# EAGLE design S603D (EAGLE 6.6.0)
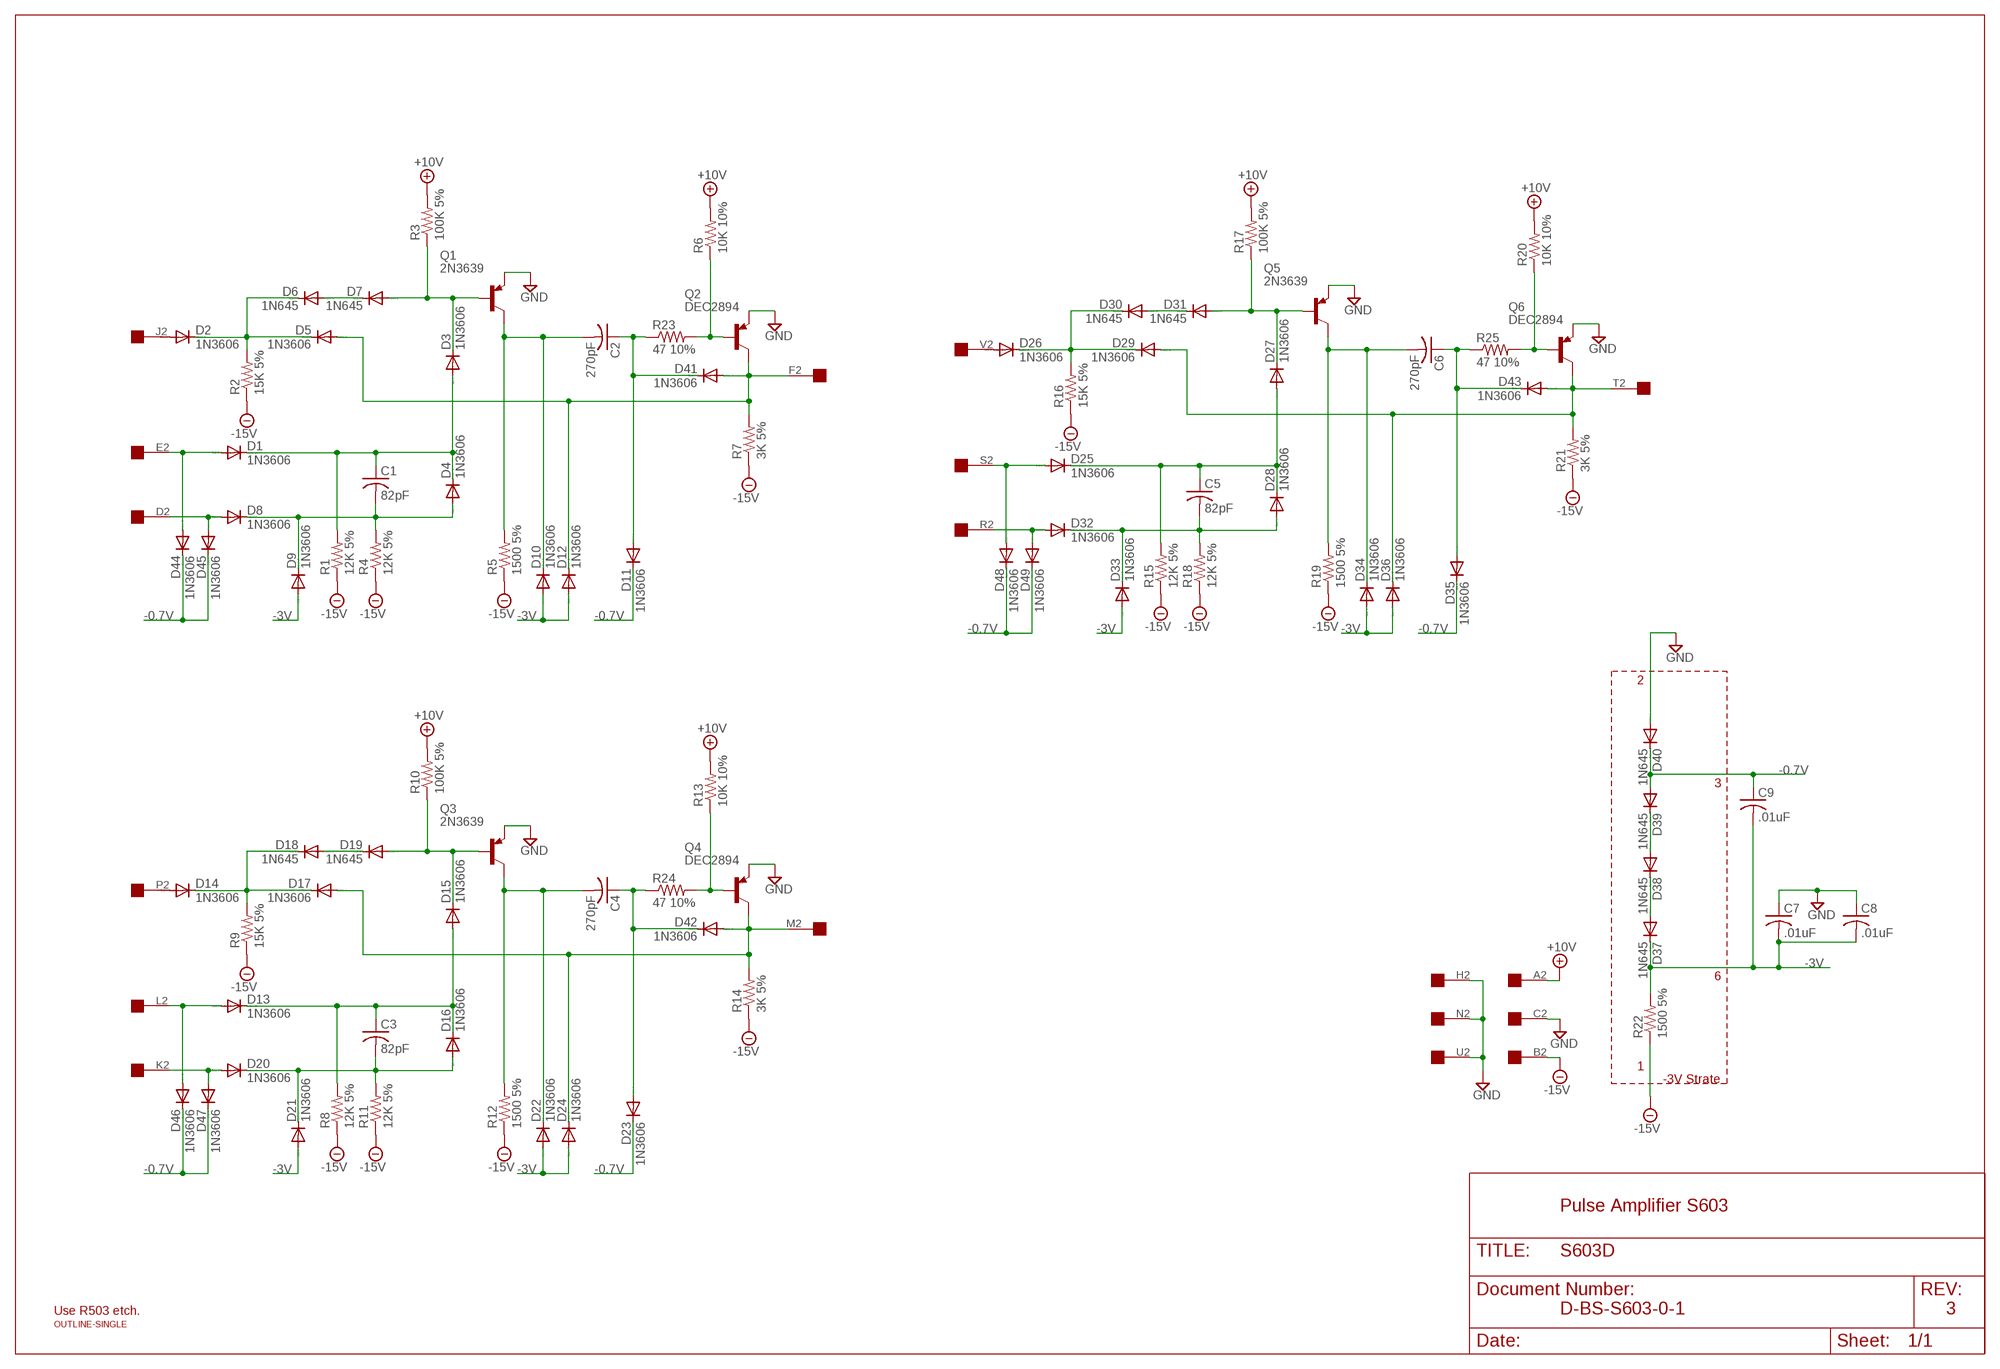
[diagram p0: schematic, sheet 1]

## Parts
C1  82pF  C-US050-025X075  [C050-025X075]
C2  270pF  C-US050-025X075  [C050-025X075]
C3  82pF  C-US050-025X075  [C050-025X075]
C4  270pF  C-US050-025X075  [C050-025X075]
C5  82pF  C-US050-025X075  [C050-025X075]
C6  270pF  C-US050-025X075  [C050-025X075]
C7  .01uF  C-US050-025X075  [C050-025X075]
C8  .01uF  C-US050-025X075  [C050-025X075]
C9  .01uF  C-US050-025X075  [C050-025X075]
D1  1N3606  1N4148DO35-10  [DO35-10]
D2  1N3606  1N4148DO35-10  [DO35-10]
D3  1N3606  1N4148DO35-10  [DO35-10]
D4  1N3606  1N4148DO35-10  [DO35-10]
D5  1N3606  1N4148DO35-10  [DO35-10]
D6  1N645  1N4148DO35-10  [DO35-10]
D7  1N645  1N4148DO35-10  [DO35-10]
D8  1N3606  1N4148DO35-10  [DO35-10]
D9  1N3606  1N4148DO35-10  [DO35-10]
D10  1N3606  1N4148DO35-10  [DO35-10]
D11  1N3606  1N4148DO35-10  [DO35-10]
D12  1N3606  1N4148DO35-10  [DO35-10]
D13  1N3606  1N4148DO35-10  [DO35-10]
D14  1N3606  1N4148DO35-10  [DO35-10]
D15  1N3606  1N4148DO35-10  [DO35-10]
D16  1N3606  1N4148DO35-10  [DO35-10]
D17  1N3606  1N4148DO35-10  [DO35-10]
D18  1N645  1N4148DO35-10  [DO35-10]
D19  1N645  1N4148DO35-10  [DO35-10]
D20  1N3606  1N4148DO35-10  [DO35-10]
D21  1N3606  1N4148DO35-10  [DO35-10]
D22  1N3606  1N4148DO35-10  [DO35-10]
D23  1N3606  1N4148DO35-10  [DO35-10]
D24  1N3606  1N4148DO35-10  [DO35-10]
D25  1N3606  1N4148DO35-10  [DO35-10]
D26  1N3606  1N4148DO35-10  [DO35-10]
D27  1N3606  1N4148DO35-10  [DO35-10]
D28  1N3606  1N4148DO35-10  [DO35-10]
D29  1N3606  1N4148DO35-10  [DO35-10]
D30  1N645  1N4148DO35-10  [DO35-10]
D31  1N645  1N4148DO35-10  [DO35-10]
D32  1N3606  1N4148DO35-10  [DO35-10]
D33  1N3606  1N4148DO35-10  [DO35-10]
D34  1N3606  1N4148DO35-10  [DO35-10]
D35  1N3606  1N4148DO35-10  [DO35-10]
D36  1N3606  1N4148DO35-10  [DO35-10]
D37  1N645  1N4148DO35-10  [DO35-10]
D38  1N645  1N4148DO35-10  [DO35-10]
D39  1N645  1N4148DO35-10  [DO35-10]
D40  1N645  1N4148DO35-10  [DO35-10]
D41  1N3606  1N4148DO35-10  [DO35-10]
D42  1N3606  1N4148DO35-10  [DO35-10]
D43  1N3606  1N4148DO35-10  [DO35-10]
D44  1N3606  1N4148DO35-10  [DO35-10]
D45  1N3606  1N4148DO35-10  [DO35-10]
D46  1N3606  1N4148DO35-10  [DO35-10]
D47  1N3606  1N4148DO35-10  [DO35-10]
D48  1N3606  1N4148DO35-10  [DO35-10]
D49  1N3606  1N4148DO35-10  [DO35-10]
Q1  2N3639  2N2904  [TO39]
Q2  DEC2894  2N2904  [TO39]
Q3  2N3639  2N2904  [TO39]
Q4  DEC2894  2N2904  [TO39]
Q5  2N3639  2N2904  [TO39]
Q6  DEC2894  2N2904  [TO39]
R1  12K 5%  R-US_0207/10  [0207/10]
R2  15K 5%  R-US_0207/10  [0207/10]
R3  100K 5%  R-US_0207/10  [0207/10]
R4  12K 5%  R-US_0207/10  [0207/10]
R5  1500 5%  R-US_0207/10  [0207/10]
R6  10K 10%  R-US_0207/10  [0207/10]
R7  3K 5%  R-US_0207/10  [0207/10]
R8  12K 5%  R-US_0207/10  [0207/10]
R9  15K 5%  R-US_0207/10  [0207/10]
R10  100K 5%  R-US_0207/10  [0207/10]
R11  12K 5%  R-US_0207/10  [0207/10]
R12  1500 5%  R-US_0207/10  [0207/10]
R13  10K 10%  R-US_0207/10  [0207/10]
R14  3K 5%  R-US_0207/10  [0207/10]
R15  12K 5%  R-US_0207/10  [0207/10]
R16  15K 5%  R-US_0207/10  [0207/10]
R17  100K 5%  R-US_0207/10  [0207/10]
R18  12K 5%  R-US_0207/10  [0207/10]
R19  1500 5%  R-US_0207/10  [0207/10]
R20  10K 10%  R-US_0207/10  [0207/10]
R21  3K 5%  R-US_0207/10  [0207/10]
R22  1500 5%  R-US_0207/10  [0207/10]
R23  47 10%  R-US_0207/10  [0207/10]
R24  47 10%  R-US_0207/10  [0207/10]
R25  47 10%  R-US_0207/10  [0207/10]
U$1  OUTLINE-SINGLE  [SINGLE]
U$2  EDGE-1  [EDGE-CON1]

## Nets
+10V [Supply]: R3.2 R6.2 R10.2 R13.2 R17.2 R20.2 U$2.A2
-0.7V [Supply]: C9.1 D11.C D23.C D35.C D39.A D40.C D44.C D45.C D46.C D47.C D48.C D49.C
-3V [Supply]: C7.2 C8.2 C9.2 D9.A D10.A D12.A D21.A D22.A D24.A D33.A D34.A D36.A D37.C R22.2
-15V [Supply]: R1.1 R2.1 R4.1 R5.1 R7.1 R8.1 R9.1 R11.1 R12.1 R14.1 R15.1 R16.1 R18.1 R19.1 R21.1 R22.1 U$2.B2
GND [Supply]: C7.1 C8.1 D40.A Q1.1(E) Q2.1(E) Q3.1(E) Q4.1(E) Q5.1(E) Q6.1(E) U$2.C2 U$2.H2 U$2.N2 U$2.U2
N$1: D2.A U$2.J2
N$2: D2.C D5.C D6.C R2.2
N$3: D1.A D44.A U$2.E2
N$4: D8.A D45.A U$2.D2
N$5: C1.1 D1.C D3.A D4.C R1.2
N$6: C1.2 D4.A D8.C D9.C R4.2
N$7: D6.A D7.C
N$8 [Supply]: D38.A D39.C
N$9 [Supply]: D37.A D38.C
N$10: D3.C D7.A Q1.2(B) R3.1
N$11: C2.2 D10.C Q1.3(C) R5.2
N$12: C2.1 D11.A D41.C R23.1
N$13: Q2.2(B) R6.1 R23.2
N$14: D5.A D12.C D41.A Q2.3(C) R7.2 U$2.F2
N$15: D13.A D46.A U$2.L2
N$16: D20.A D47.A U$2.K2
N$17: C3.1 D13.C D15.A D16.C R8.2
N$18: C3.2 D16.A D20.C D21.C R11.2
N$19: D25.A D48.A U$2.S2
N$20: D32.A D49.A U$2.R2
N$21: C5.1 D25.C D27.A D28.C R15.2
N$22: C5.2 D28.A D32.C D33.C R18.2
N$23: D26.A U$2.V2
N$24: D26.C D29.C D30.C R16.2
N$25: D30.A D31.C
N$26: D27.C D31.A Q5.2(B) R17.1
N$27: C6.2 D34.C Q5.3(C) R19.2
N$28: C6.1 D35.A D43.C R25.1
N$29: Q6.2(B) R20.1 R25.2
N$30: D29.A D36.C D43.A Q6.3(C) R21.2 U$2.T2
N$31: D14.A U$2.P2
N$32: D14.C D17.C D18.C R9.2
N$33: D18.A D19.C
N$34: D15.C D19.A Q3.2(B) R10.1
N$35: C4.2 D22.C Q3.3(C) R12.2
N$36: C4.1 D23.A D42.C R24.1
N$37: Q4.2(B) R13.1 R24.2
N$38: D17.A D24.C D42.A Q4.3(C) R14.2 U$2.M2

## Notes on the sheet
- 2
- 3
- 6
- 1
- -3V Strate
- Pulse Amplifier S603
- Use R503 etch. | D-BS-S603-0-1 | 3

## Library data of the parts
C1-C9 = rcl:C-US: CAPACITOR, American symbol
D1-D49 = diode:1N4148: DIODE high speed (Philips)
Q1-Q6 = transistor-pnp:2N2904*: PNP Transistror
R1-R25 = rcl:R-US_: RESISTOR, American symbol
U$1 = dec-con:OUTLINE-*: Board outlines for DEC boards.
U$2 = dec-con:EDGE-1: Single-Sided DEC Edge Connector -- (side 2)

## Net classes
1 Supply: width 0.813 mm

## Board
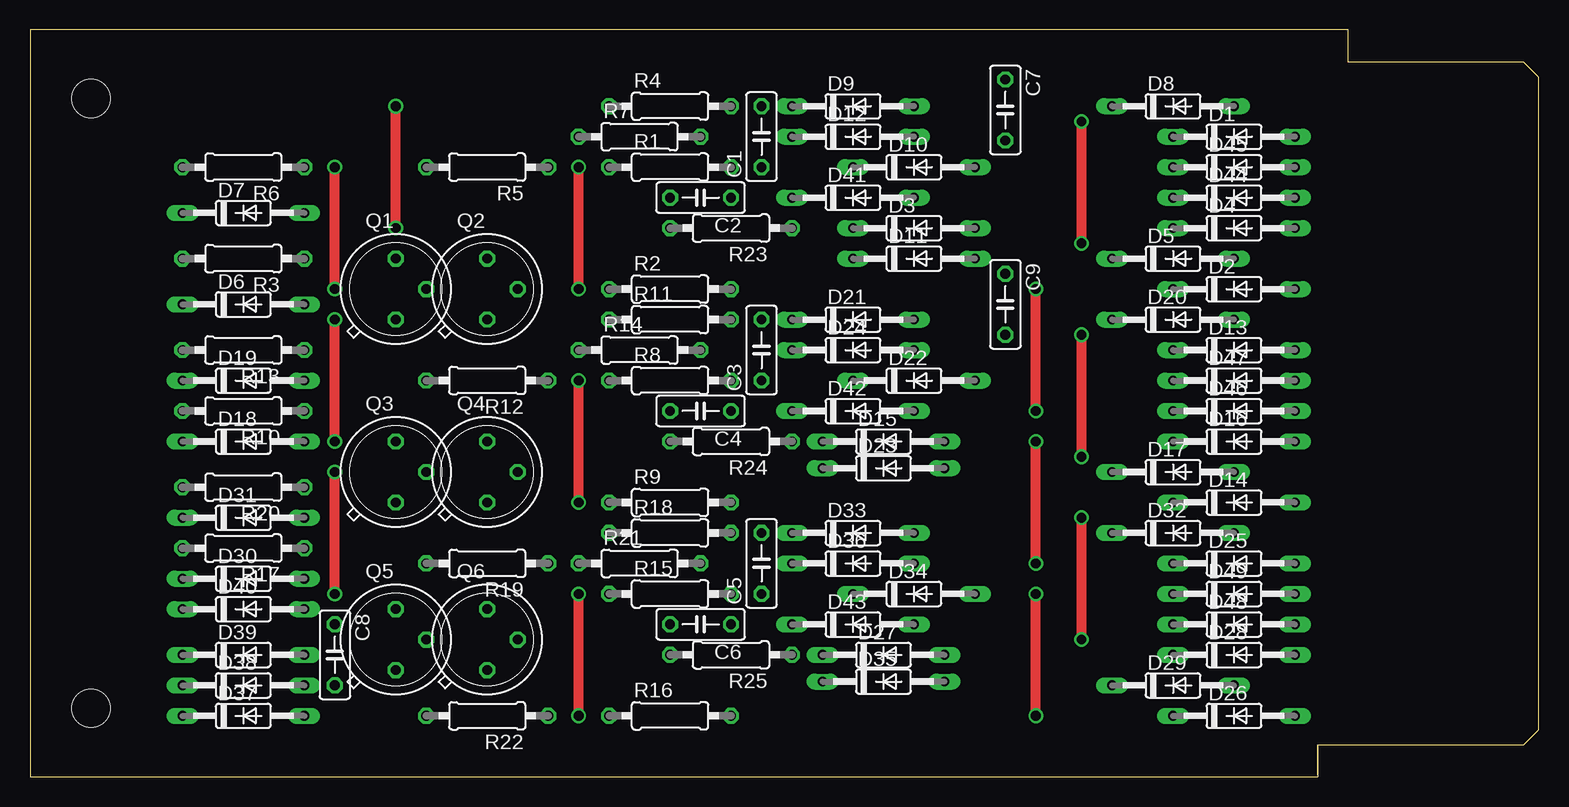
[diagram p1: board, top side]
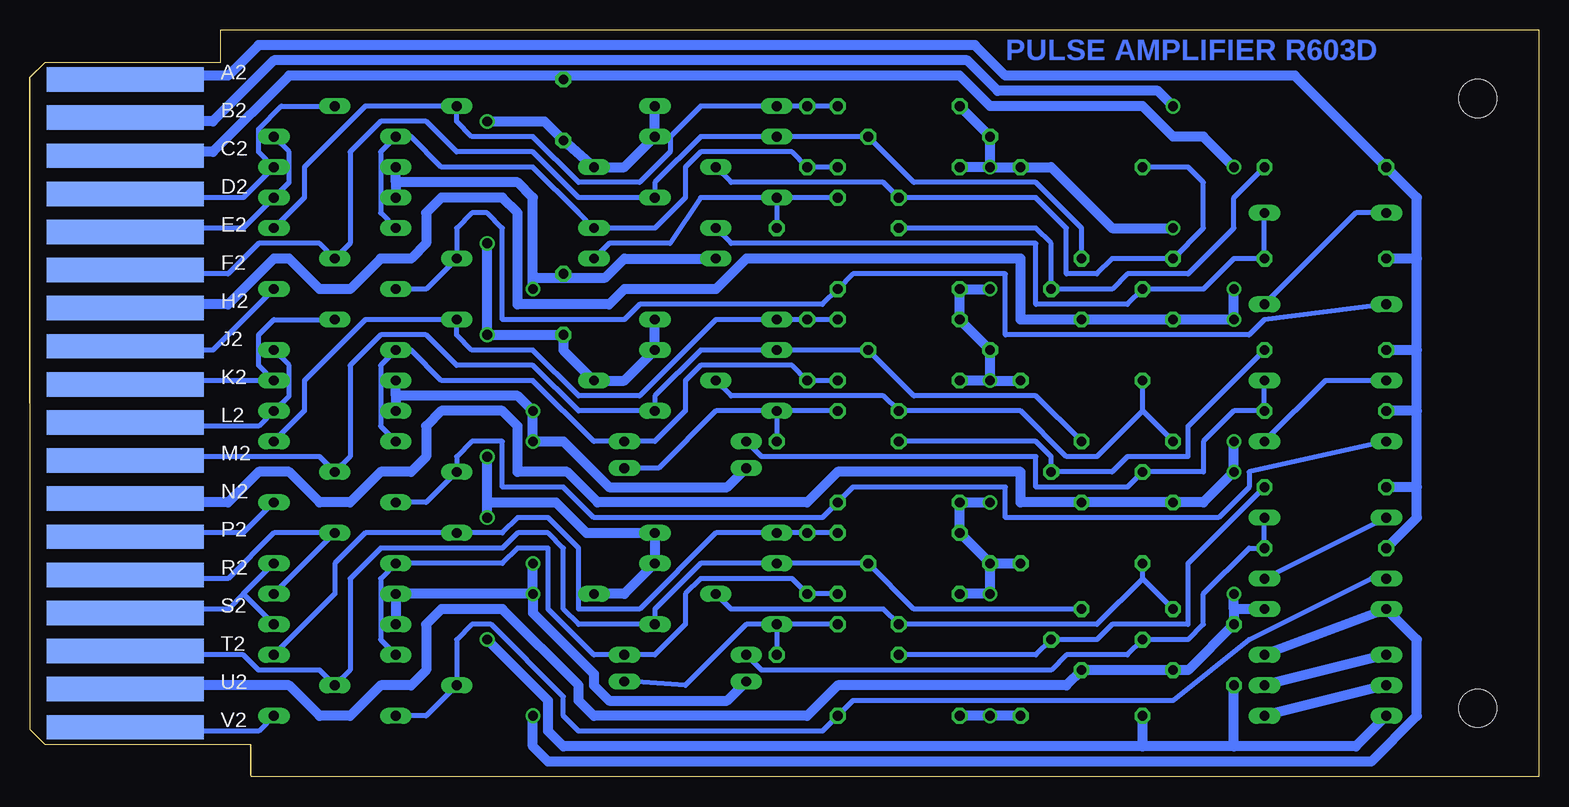
[diagram p2: board, bottom side, seen from below]

Size 125.73 x 62.23 mm. Coordinates in mm from the lower left corner, seen from the top.
Copper layers (1+16): Top 0.035mm / dielectric 1.5mm / Bottom 0.035mm
Design rules "16mils": minimum track width 16mil, minimum drill 32mil, track to track 15mil, track to pad 10mil, pad to pad 10mil, via to via 10mil, smd to smd 10mil, copper to edge 13mil, drill to drill 10mil, minimum pad ring 10mil, minimum via ring 8mil, stop-mask expansion 0mil, vias tented up to drill 0mil, thermal gap 10mil

### Footprints (pad centres in the part's own frame; a part is rotated, then mirrored left to right if it is on the bottom)
C050-025X075 = drill 0.813 octagon: 1 -2.54,0; 2 2.54,0
DO35-10 = drill 0.813 long: A 5.08,0; C -5.08,0
TO39 = drill 0.813 octagon: 1 0,-2.54; 2 2.54,0; 3 0,2.54
0207/10 = drill 0.813 octagon: 1 -5.08,0; 2 5.08,0
SINGLE = hole 3.175: 120.65,56.515; 120.65,5.715
EDGE-CON1 = smd 13.106 x 2.032 bottom: A2 7.938,4.128; B2 7.938,7.303; C2 7.938,10.477; D2 7.938,13.652; E2 7.938,16.828; F2 7.938,20.003; H2 7.938,23.177; J2 7.938,26.352; K2 7.938,29.527; L2 7.938,32.703; M2 7.938,35.877; N2 7.938,39.053; P2 7.938,42.227; R2 7.938,45.403; S2 7.938,48.578; T2 7.938,51.752; U2 7.938,54.928; V2 7.938,58.102

### Placement (x,y rotation side)
C1  60.96,53.34 90 top
C2  55.88,48.26 180 top
C3  60.96,35.56 90 top
C4  55.88,30.48 180 top
C5  60.96,17.78 90 top
C6  55.88,12.7 180 top
C7  81.28,55.56 270 top
C8  25.4,10.16 270 top
C9  81.28,39.37 270 top
D1  100.33,53.34 0 top
D2  100.33,40.64 0 top
D3  73.66,45.72 0 top
D4  100.33,45.72 0 top
D5  95.25,43.18 0 top
D6  17.78,39.37 0 top
D7  17.78,46.99 0 top
D8  95.25,55.88 0 top
D9  68.58,55.88 0 top
D10  73.66,50.8 0 top
D11  73.66,43.18 0 top
D12  68.58,53.34 0 top
D13  100.33,35.56 0 top
D14  100.33,22.86 0 top
D15  71.12,27.94 0 top
D16  100.33,27.94 0 top
D17  95.25,25.4 0 top
D18  17.78,27.94 0 top
D19  17.78,33.02 0 top
D20  95.25,38.1 0 top
D21  68.58,38.1 0 top
D22  73.66,33.02 0 top
D23  71.12,25.72 0 top
D24  68.58,35.56 0 top
D25  100.33,17.78 0 top
D26  100.33,5.08 0 top
D27  71.12,10.16 0 top
D28  100.33,10.16 0 top
D29  95.25,7.62 0 top
D30  17.78,16.51 0 top
D31  17.78,21.59 0 top
D32  95.25,20.32 0 top
D33  68.58,20.32 0 top
D34  73.66,15.24 0 top
D35  71.12,7.94 0 top
D36  68.58,17.78 0 top
D37  17.78,5.08 0 top
D38  17.78,7.62 0 top
D39  17.78,10.16 0 top
D40  17.78,13.97 0 top
D41  68.58,48.26 0 top
D42  68.58,30.48 0 top
D43  68.58,12.7 0 top
D44  100.33,48.26 0 top
D45  100.33,50.8 0 top
D46  100.33,30.48 0 top
D47  100.33,33.02 0 top
D48  100.33,12.7 0 top
D49  100.33,15.24 0 top
Q1  30.48,40.64 0 top
Q2  38.1,40.64 0 top
Q3  30.48,25.4 0 top
Q4  38.1,25.4 0 top
Q5  30.48,11.43 0 top
Q6  38.1,11.43 0 top
R1  53.34,50.8 0 top
R2  53.34,40.64 0 top
R3  17.78,43.18 180 top
R4  53.34,55.88 0 top
R5  38.1,50.8 180 top
R6  17.78,50.8 180 top
R7  50.8,53.34 0 top
R8  53.34,33.02 0 top
R9  53.34,22.86 0 top
R10  17.78,30.48 180 top
R11  53.34,38.1 0 top
R12  38.1,33.02 180 top
R13  17.78,35.56 180 top
R14  50.8,35.56 0 top
R15  53.34,15.24 0 top
R16  53.34,5.08 0 top
R17  17.78,19.05 180 top
R18  53.34,20.32 0 top
R19  38.1,17.78 180 top
R20  17.78,24.13 180 top
R21  50.8,17.78 0 top
R22  38.1,5.08 180 top
R23  58.42,45.72 180 top
R24  58.42,27.94 180 top
R25  58.42,10.16 180 top
U$1  125.73,62.23 180 top
U$2  125.73,62.23 180 top

### Tracks (layer width: path | path; a pad name or v marks a point on that pad's centre or on a via)
+10V
  Bottom 0.813: U$2.A2 116.84,58.04 116.84,58.42 109.22,58.42 106.68,60.96 46.99,60.96 44.45,58.42 20.32,58.42 R6.2 10.16,48.26 10.16,43.18 | 10.16,24.13 10.16,21.59 R17.2 | 10.16,24.13 10.16,30.48 | 10.16,30.48 10.16,35.56 | 10.16,35.56 10.16,43.18 | 10.16,24.13 R20.2 | 10.16,30.48 R10.2 | 10.16,35.56 R13.2 | 10.16,43.18 R3.2
-0.7V  (via drill 0.81)
  Top 0.813: v83.82,5.08 v83.82,15.24 | v83.82,17.78 v83.82,27.94 | v83.82,30.48 v83.82,40.64
  Bottom 0.813: 95.25,49.53 D45.C | 95.25,49.53 D44.C | 95.25,31.75 D47.C | 95.25,31.75 D46.C | D48.C D49.C v83.82,15.24 | v83.82,15.24 v83.82,17.78 | 95.25,31.75 85.09,31.75 v83.82,30.48 v83.82,27.94 81.28,27.94 77.47,24.13 67.63,24.13 D23.C | 95.25,49.53 85.09,49.53 83.82,48.26 83.82,41.91 | v83.82,40.64 83.82,41.91 | D39.A D40.C 10.16,11.43 10.16,5.08 13.97,1.27 82.55,1.27 83.82,2.54 v83.82,5.08 | 83.82,41.91 83.82,41.59 81.28,41.59 | 80.96,41.91 C9.1 81.28,41.59 | 81.28,41.59 77.79,41.59 76.2,43.18 D11.C | D35.C 67.63,6.35 77.47,6.35 78.74,7.62 78.74,8.57 83.82,13.65 v83.82,15.24
-3V  (via drill 0.81)
  Top 0.813: v87.63,44.45 v87.63,54.61 | v87.63,26.67 v87.63,36.83 | v87.63,11.43 v87.63,21.59
  Bottom 0.813: v87.63,44.45 v87.63,36.83 C9.2 81.28,35.56 D22.A 76.2,33.02 D24.A D21.A | v87.63,21.59 87.63,22.86 | 87.63,22.86 v87.63,26.67 | v87.63,54.61 82.87,54.61 C7.2 D10.A 76.2,50.8 D12.A D9.A | D37.C 15.24,2.54 25.4,2.54 | 25.4,2.54 33.02,2.54 | 25.4,2.54 C8.2 | 33.02,2.54 R22.2 | 33.02,2.54 81.28,2.54 82.55,3.81 82.55,6.35 v87.63,11.43 | D34.A 76.2,15.24 D36.A D33.A 79.38,20.32 81.92,22.86 87.63,22.86
-15V  (via drill 0.81)
  Top 0.813: v45.72,40.64 v45.72,50.8 | v30.48,45.72 v30.48,55.88 | v45.72,5.08 v45.72,15.24 | v45.72,22.86 v45.72,33.02
  Bottom 0.813: U$2.B2 117.13,54.9 116.84,54.61 110.49,54.61 105.41,59.69 47.62,59.69 45.09,57.15 31.75,57.15 v30.48,55.88 | R4.1 R7.1 v45.72,50.8 | v45.72,50.8 R1.1 | v30.48,45.72 35.56,45.72 40.64,50.8 R5.1 v45.72,50.8 | v45.72,33.02 R12.1 | v45.72,33.02 R14.1 R11.1 R2.1 | R2.1 v45.72,40.64 R2.1 | R22.1 v45.72,5.08 R16.1 | R21.1 v45.72,15.24 R15.1 | R21.1 R18.1 R9.1 v45.72,22.86 | R21.1 R19.1 | v45.72,33.02 R8.1
GND  (via drill 0.81)
  Top 0.813: v25.4,40.64 v25.4,50.8 | v25.4,27.94 v25.4,38.1 | v25.4,15.24 v25.4,25.4
  Bottom 0.813: U$2.C2 117.17,51.74 116.84,52.07 110.49,52.07 104.14,58.42 81.28,58.42 | U$2.H2 117.17,39.04 116.84,39.37 109.22,39.37 105.41,43.18 104.14,43.18 101.6,40.64 99.06,40.64 96.52,43.18 93.98,43.18 92.71,44.45 92.71,46.99 91.44,48.26 86.36,48.26 85.09,46.99 85.09,39.37 77.47,39.37 76.2,40.64 68.58,40.64 66.04,43.18 43.18,43.18 43.18,38.1 Q2.1 Q1.1 v25.4,38.1 v25.4,40.64 | U$2.N2 117.17,23.19 116.84,22.86 109.22,22.86 106.68,25.4 104.14,25.4 101.6,22.86 99.06,22.86 96.52,25.4 93.98,25.4 92.71,26.67 92.71,29.21 91.44,30.48 86.36,30.48 85.09,29.21 85.09,25.4 80.96,25.4 78.42,22.86 60.96,22.86 58.42,25.4 43.18,25.4 43.18,22.86 Q4.1 Q3.1 27.94,22.86 v25.4,25.4 v25.4,27.94 | U$2.U2 117.2,7.26 116.84,7.62 104.14,7.62 101.6,5.08 99.06,5.08 96.52,7.62 93.98,7.62 92.71,8.89 92.71,12.7 91.44,13.97 86.36,13.97 80.01,7.62 80.01,6.35 78.74,5.08 60.96,5.08 58.42,7.62 39.37,7.62 Q6.1 Q5.1 29.21,8.89 C8.1 25.4,13.97 | 81.28,58.42 C7.1 | 81.28,58.42 48.26,58.42 45.72,55.88 33.02,55.88 30.48,53.34 27.94,53.34 v25.4,50.8 | D40.A 25.4,13.97 | 25.4,13.97 v25.4,15.24
N$1
  Bottom 0.406: U$2.J2 117.17,35.89 116.84,35.56 110.49,35.56 D2.A
N$2
  Bottom 0.406: D2.C 92.71,40.64 D5.C 90.17,45.72 88.9,46.99 87.63,46.99 86.36,45.72 86.36,38.1 76.2,38.1 74.93,39.37 59.69,39.37 R2.2 57.15,41.91 44.45,41.91 44.45,36.83 24.13,36.83 22.86,38.1 D6.C
N$3
  Bottom 0.406: D1.A 104.14,52.07 104.14,49.53 D44.A 107.95,45.72 116.84,45.72 117.17,45.39 U$2.E2
N$4
  Bottom 0.406: U$2.D2 117.14,48.56 116.84,48.26 107.95,48.26 D45.A 106.68,52.07 106.68,53.98 104.78,55.88 D8.A
N$5
  Bottom 0.406: D4.C 96.52,46.99 96.52,52.07 D1.C 93.98,53.34 91.44,50.8 83.82,50.8 80.01,46.99 D3.A 73.66,45.72 71.12,48.26 71.12,50.8 69.85,52.07 62.23,52.07 C1.1 R1.2
N$6
  Bottom 0.406: D4.A 102.87,48.26 102.87,50.8 97.79,55.88 D8.C 90.17,54.61 88.9,53.34 83.82,53.34 80.01,49.53 74.93,49.53 72.39,52.07 72.39,53.34 69.85,55.88 D9.C C1.2 R4.2
N$7
  Bottom 0.406: D7.C 15.24,46.99 D6.A
N$8
  Bottom 0.813: D39.C D38.A
N$9
  Bottom 0.813: D38.C D37.A
N$10
  Bottom 0.406: D7.A R3.1 25.4,43.18 27.94,40.64 Q1.2 34.29,39.37 41.91,39.37 41.91,44.45 67.31,44.45 D3.C
N$11
  Bottom 0.406: D10.C 67.31,49.53 54.61,49.53 C2.2 41.91,48.26 39.37,45.72 39.37,41.91 36.83,41.91 35.56,43.18 Q1.3 27.94,45.72 27.94,49.53 29.21,50.8 R5.2
N$12
  Bottom 0.406: C2.1 D41.C | D41.C R23.1 | D11.A 77.47,44.45 72.39,44.45 69.85,48.26 D41.C
N$13
  Bottom 0.406: R6.1 25.4,48.26 25.4,45.72 29.21,41.91 34.29,41.91 35.56,40.64 Q2.2 40.64,44.45 41.91,45.72 R23.2
N$14
  Bottom 0.406: U$2.F2 117.12,42.19 116.84,41.91 109.22,41.91 106.68,44.45 101.6,44.45 D5.A 99.06,44.45 99.06,52.07 96.52,54.61 92.71,54.61 90.17,52.07 83.82,52.07 80.01,48.26 D41.A 73.66,49.53 69.85,53.34 D12.C R7.2 52.07,49.53 41.91,49.53 38.1,45.72 Q2.3
N$15
  Bottom 0.406: D13.A 104.14,34.29 104.14,31.75 D46.A 106.68,29.21 116.84,29.21 117.17,29.54 U$2.L2
N$16
  Bottom 0.406: D20.A 105.41,38.1 106.68,36.83 106.68,34.29 D47.A 116.84,33.02 117.14,32.72 U$2.K2
N$17
  Bottom 0.406: D16.C 96.52,29.21 96.52,34.29 D13.C 93.98,35.56 91.44,33.02 83.82,33.02 78.74,27.94 D15.A 73.66,27.94 71.12,30.48 71.12,33.02 69.85,34.29 62.23,34.29 C3.1 R8.2
N$18
  Bottom 0.406: D16.A 102.87,30.48 102.87,33.02 97.79,38.1 D20.C 90.17,36.83 88.9,35.56 83.82,35.56 80.01,31.75 74.93,31.75 68.58,38.1 D21.C C3.2 R11.2
N$19
  Bottom 0.406: U$2.S2 117.14,13.66 116.84,13.97 109.22,13.97 107.95,15.24 | 107.95,15.24 D25.A | D48.A 107.95,15.24
N$20
  Bottom 0.406: U$2.R2 117.17,16.84 116.84,16.51 109.22,16.51 105.41,20.32 D32.A D49.A
N$21
  Bottom 0.406: D28.C 96.52,11.43 96.52,16.51 D25.C 86.36,17.78 85.09,19.05 82.55,19.05 82.55,13.97 78.74,10.16 D27.A 73.66,10.16 71.12,12.7 71.12,15.24 69.85,16.51 62.23,16.51 C5.1 R15.2
N$22
  Bottom 0.406: D28.A 100.33,15.24 100.33,17.78 97.79,20.32 D32.C 86.36,20.32 85.09,21.59 82.55,21.59 80.01,19.05 80.01,13.97 74.93,13.97 68.58,20.32 D33.C C5.2 R18.2
N$23
  Bottom 0.406: U$2.V2 117.16,4.13 116.84,3.81 106.68,3.81 D26.A
N$24
  Bottom 0.406: D26.C 92.71,5.08 D29.C 90.17,11.43 88.9,12.7 87.31,12.7 81.28,6.67 81.28,5.08 80.01,3.81 59.69,3.81 R16.2 57.15,6.35 30.48,6.35 24.13,11.43 13.97,16.51 D30.C
N$25
  Bottom 0.406: D31.C D30.A
N$26
  Bottom 0.406: D31.A R17.1 24.13,19.05 27.94,15.24 27.94,12.7 29.21,11.43 Q5.2 34.29,10.16 39.37,10.16 40.64,8.89 64.77,8.89 D27.C
N$27
  Bottom 0.406: Q5.3 33.02,16.51 | 33.02,16.51 R19.2 | 33.02,16.51 36.83,12.7 C6.2 54.61,13.97 67.31,13.97 D34.C
N$28
  Bottom 0.406: C6.1 D43.C | D43.C R25.1 | D35.A 75.25,7.94 71.12,7.62 66.04,12.7 D43.C
N$29
  Bottom 0.406: R20.1 29.21,17.78 29.21,12.7 35.56,12.7 36.83,11.43 Q6.2 41.91,10.16 R25.2
N$30
  Bottom 0.406: U$2.T2 117.17,10.49 116.84,10.16 107.95,10.16 106.68,8.89 101.6,8.89 D29.A 99.06,8.89 99.06,16.51 96.52,19.05 86.36,19.05 85.09,20.32 82.55,20.32 81.28,19.05 81.28,13.97 80.01,12.7 D43.A 73.66,13.97 69.85,17.78 D36.C R21.2 52.07,13.97 Q6.3
N$31
  Bottom 0.406: U$2.P2 117.17,19.99 116.84,20.32 107.95,20.32 D14.A
N$32
  Bottom 0.406: D14.C 92.71,22.86 D17.C 90.17,26.67 88.9,27.94 86.36,27.94 86.36,24.13 81.28,24.13 78.74,21.59 59.69,21.59 R9.2 57.15,24.13 44.45,24.13 44.45,21.59 26.67,21.59 24.13,24.13 24.13,25.4 D18.C
N$33
  Bottom 0.406: D19.C 17.78,33.02 D18.A
N$34
  Bottom 0.406: D19.A R10.1 25.4,30.48 27.94,27.94 27.94,25.4 Q3.2 34.29,24.13 41.91,24.13 41.91,26.67 64.77,26.67 D15.C
N$35
  Bottom 0.406: Q3.3 33.02,30.48 | 33.02,30.48 R12.2 | 33.02,30.48 36.83,26.67 39.37,26.67 43.18,30.48 C4.2 54.61,31.75 67.31,31.75 D22.C
N$36
  Bottom 0.406: C4.1 D42.C | D42.C R24.1 | D23.A 73.34,25.72 68.58,30.48 D42.C
N$37
  Bottom 0.406: R13.1 29.21,29.21 29.21,26.67 34.29,26.67 35.56,25.4 Q4.2 40.64,26.67 41.91,27.94 R24.2
N$38
  Bottom 0.406: U$2.M2 117.17,26.34 116.84,26.67 101.6,26.67 D17.A 99.06,26.67 99.06,34.29 96.52,36.83 92.71,36.83 90.17,34.29 83.82,34.29 80.01,30.48 D42.A 73.66,31.75 69.85,35.56 D24.C R14.2 52.07,31.75 41.91,31.75 Q4.3

### Text on the board
Bottom: PULSE AMPLIFIER R603D